# EAGLE schematic Transmitter (EAGLE 7.7.0)
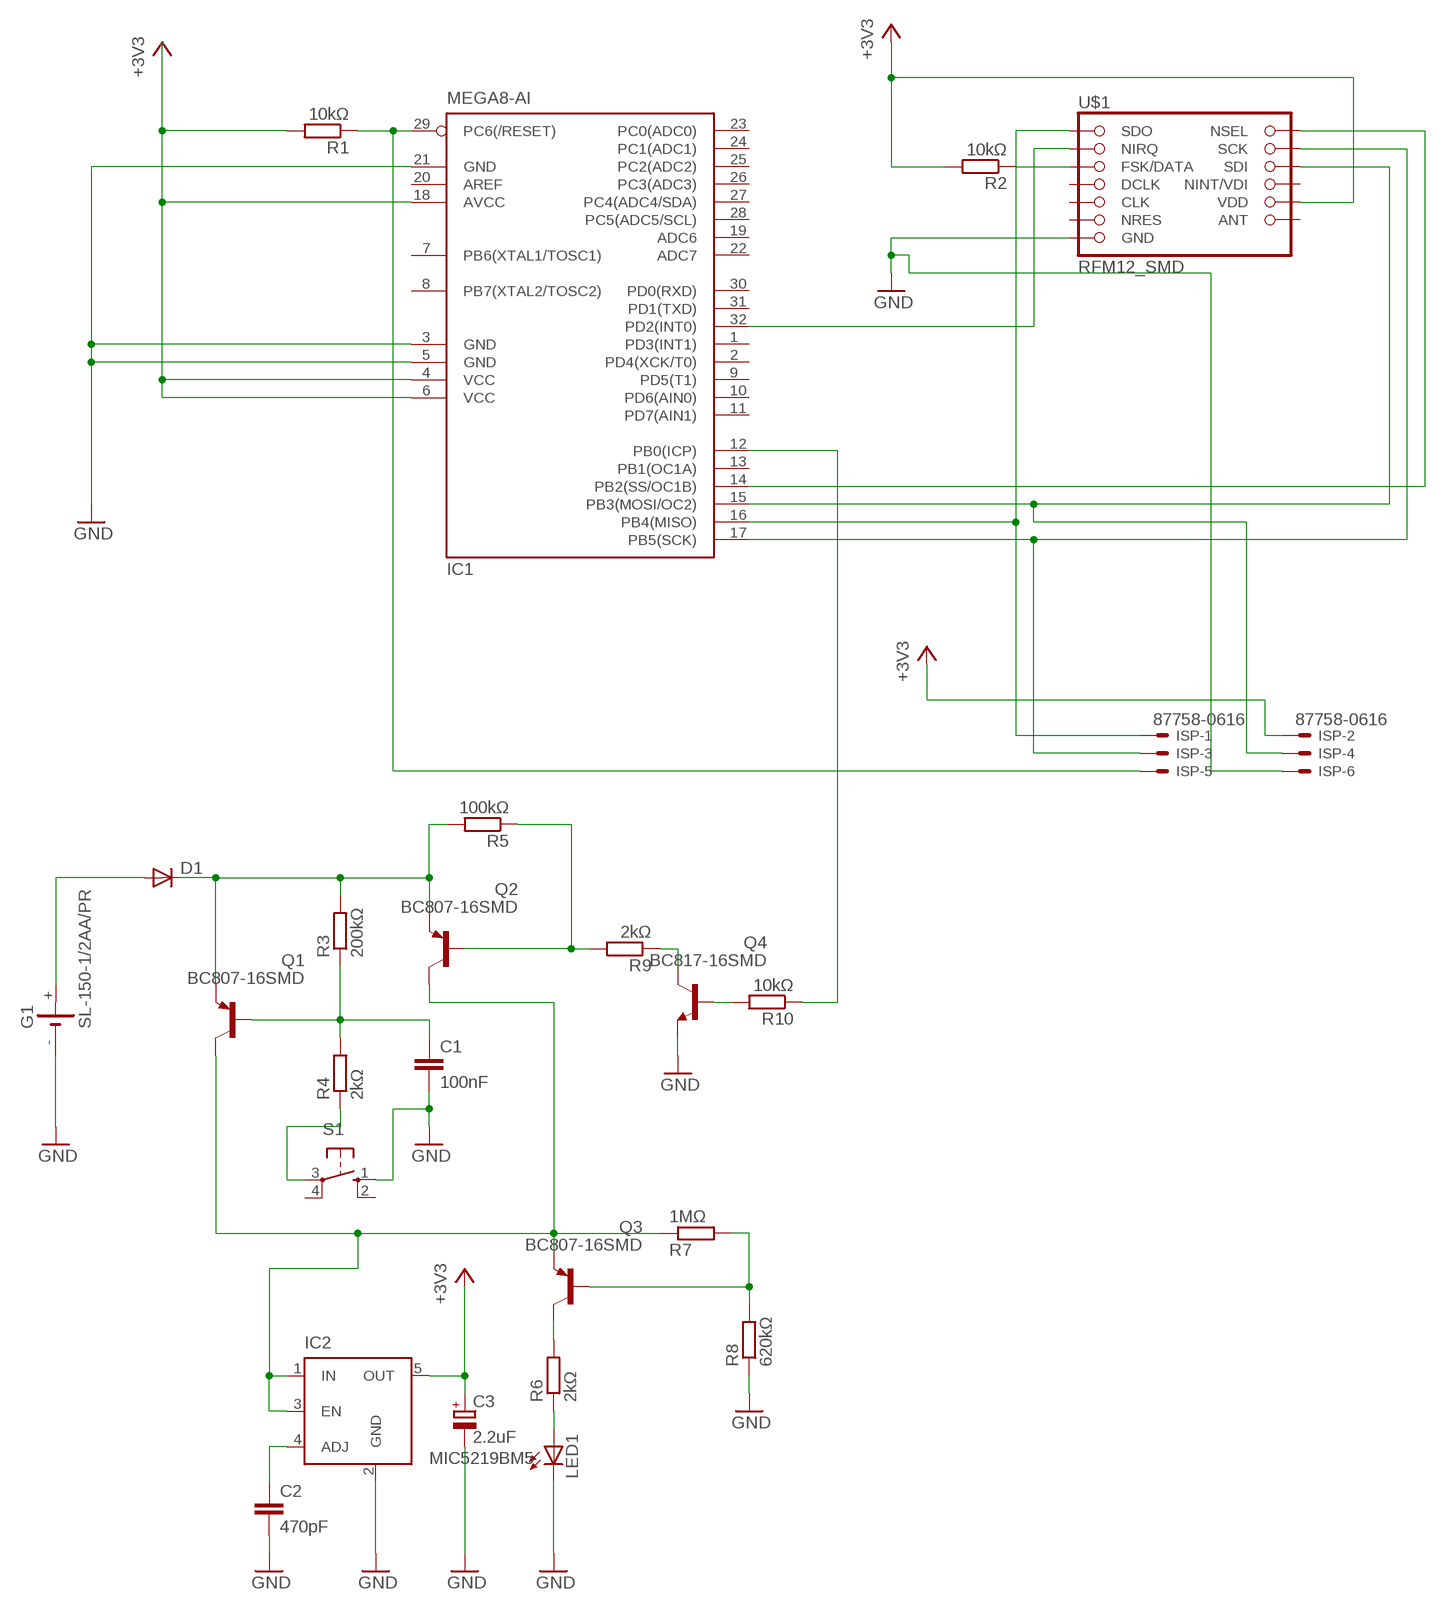
[diagram p0: schematic, sheet 1]

## Parts
C1  100nF  C-EUC0603  [C0603]
C2  470pF  C-EUC0603  [C0603]
C3  2.2uF  CPOL-EUSMCA  [SMC_A]
D1  DIODE-SOD80C  [SOD80C]
G1  SL-150-1/2AA/PR  [SL-150-1/2AA/PR]
IC1  MEGA8-AI  [TQFP32-08]
IC2  MIC5219BM5  [SOT23-5]
ISP  87758-0616  [87758-0616]
LED1  LED3MM  [LED3MM]
Q1  BC807-16SMD  [SOT23-BEC]
Q2  BC807-16SMD  [SOT23-BEC]
Q3  BC807-16SMD  [SOT23-BEC]
Q4  BC817-16SMD  [SOT23-BEC]
R1  10kΩ  R-EU_R0603  [R0603]
R2  10kΩ  R-EU_R0603  [R0603]
R3  200kΩ  R-EU_R0603  [R0603]
R4  2kΩ  R-EU_R0603  [R0603]
R5  100kΩ  R-EU_R0603  [R0603]
R6  2kΩ  R-EU_R0603  [R0603]
R7  1MΩ  R-EU_R0603  [R0603]
R8  620kΩ  R-EU_R0603  [R0603]
R9  2kΩ  R-EU_R0603  [R0603]
R10  10kΩ  R-EU_R0603  [R0603]
S1  10-XX  [B3F-10XX]
U$1  RFM12_SMD  [RFM12_SMD]

## Nets
+3V3: C3.+ IC1.4(VCC) IC1.6(VCC) IC1.18(AVCC) IC2.5(OUT) ISP.2 R1.2 R2.2 U$1.9(VDD)
GND: C1.2 C2.2 C3.- G1.- IC1.3(GND) IC1.5(GND) IC1.21(GND) IC2.2(GND) ISP.6 LED1.K(C) Q4.E R8.1 S1.1(S) U$1.7(GND) U$1.10(GND)
N$1: IC1.29(PC6(/RESET)) ISP.5 R1.1
N$2: IC1.12(PB0(ICP)) R10.1
N$3: D1.A G1.+
N$4: R2.1 U$1.3(FSK/DATA)
N$5: IC1.16(PB4(MISO)) ISP.1 U$1.1(SDO)
N$6: IC1.32(PD2(INT0)) U$1.2(NIRQ)
N$7: IC1.14(PB2(SS/OC1B)) U$1.14(NSEL)
N$8: IC1.17(PB5(SCK)) ISP.3 U$1.13(SCK)
N$9: IC1.15(PB3(MOSI/OC2)) ISP.4 U$1.12(SDI)
N$11: D1.C Q1.E Q2.E R3.2 R5.2
N$12: C1.1 Q1.B R3.1 R4.2
N$13: R4.1 S1.3(P)
N$14: Q2.B R5.1 R9.2
N$15: IC2.1(IN) IC2.3(EN) Q1.C Q2.C Q3.E R7.1
N$16: Q3.C R6.2
N$17: C2.1 IC2.4(ADJ)
N$18: LED1.A R6.1
N$19: Q3.B R7.2 R8.2
N$20: Q4.C R9.1
N$21: Q4.B R10.2
Unconnected: IC1.1(PD3(INT1)) IC1.2(PD4(XCK/T0)) IC1.7(PB6(XTAL1/TOSC1)) IC1.8(PB7(XTAL2/TOSC2)) IC1.9(PD5(T1)) IC1.10(PD6(AIN0)) IC1.11(PD7(AIN1)) IC1.13(PB1(OC1A)) IC1.19(ADC6) IC1.20(AREF) IC1.22(ADC7) IC1.23(PC0(ADC0)) IC1.24(PC1(ADC1)) IC1.25(PC2(ADC2)) IC1.26(PC3(ADC3)) IC1.27(PC4(ADC4/SDA)) IC1.28(PC5(ADC5/SCL)) IC1.30(PD0(RXD)) IC1.31(PD1(TXD)) S1.2(S1) S1.4(P1) U$1.4(DCLK) U$1.5(CLK) U$1.6(NRES) U$1.8(ANT) U$1.11(NINT/VDI)

## Library data of the parts
C1 C2 = rcl:C-EU: CAPACITOR, European symbol
C3 = rcl:CPOL-EU: POLARIZED CAPACITOR, European symbol
D1 = diode:DIODE-: DIODE
G1 = battery:SL-150-1/2AA/PR: LI BATTERY Sonnenschein
IC1 = atmel:MEGA8: MICROCONTROLLER 8 Kbytes FLASH, 1 kbytes SRAM, 512 bytes EEPROM, USART, 6-channel 10 bit ADC, 2-channel 8 bit ADC Pin compatible with Atmega48, ATMega88, ATMega168 Source: avr.lbr; MPN: ATMEGA8-16AU; OC_FARNELL: 9171371; OC_NEWARK: 73M8863
IC2 = v-reg-micrel:MIC5219BM5: VOLTAGE REGULATOR; MF: ALTERA CORPORATION; MPN: MIC5219BM5 TR; OC_FARNELL: 1100656; OC_NEWARK: 09J8939
ISP = con-molex:87758-0616: 6 Pin - 2mm Dual Row Single Wafer, Vertical T/H HDR Source: http://www.molex.com/pdm_docs/sd/877580616_sd.pdf; MPN: 87758-0616; OC_FARNELL: 7472323; OC_NEWARK: 25M5667
LED1 = led:LED: LED OSRAM: - CHIPLED LG R971, LG N971, LY N971, LG Q971, LY Q971, LO R971, LY R971 LH N974, LH R974 LS Q976, LO Q976, LY Q976 LO Q996 - Hyper CHIPLED LW Q18S LB Q993, LB Q99A, LB R99A - SideLED LS A670, LO A670, LY A670, LG A670, LP A670 LB A673, LV A673, LT A673, LW A673 LH A674 LY A675 LS A676, LA A676, LO A676, LY A676, LW A676 LS A679, LY A679, LG A679 - Hyper Micro SIDELED® LS Y876, LA Y876, LO Y876, LY Y876 LT Y87S - SmartLED LW L88C, LW L88S LB L89C, LB L89S, LG L890 LS L89K, LO L89K, LY L89K LS L896, LA L896, LO L896, LY L896 - TOPLED LS T670, LO T670, LY T670, LG T670, LP T670 LSG T670, LSP T670, LSY T670, LOP T670, LYG T670 LG T671, LOG T671, LSG T671 LB T673, LV T673, LT T673, LW T673 LH T674 LS T676, LA T676, LO T676, LY T676, LB T676, LH T676, LSB T676, LW T676 LB T67C, LV T67C, LT T67C, LS T67K, LO T67K, LY T67K, LW E67C LS E67B, LA E67B, LO E67B, LY E67B, LB E67C, LV E67C, LT E67C LW T67C LS T679, LY T679, LG T679 LS T770, LO T770, LY T770, LG T770, LP T770 LB T773, LV T773, LT T773, LW T773 LH T774 LS E675, LA E675, LY E675, LS T675 LS T776, LA T776, LO T776, LY T776, LB T776 LHGB T686 LT T68C, LB T68C - Hyper Mini TOPLED® LB M676 - Mini TOPLED Santana® LG M470 LS M47K, LO M47K, LY M47K Source: http://www.osram.convergy.de LUXEON: - LUMILED® LXK2-PW12-R00, LXK2-PW12-S00, LXK2-PW14-U00, LXK2-PW14-V00 LXK2-PM12-R00, LXK2-PM12-S00, LXK2-PM14-U00 LXK2-PE12-Q00, LXK2-PE12-R00, LXK2-PE12-S00, LXK2-PE14-T00, LXK2-PE14-U00 LXK2-PB12-K00, LXK2-PB12-L00, LXK2-PB12-M00, LXK2-PB14-N00, LXK2-PB14-P00, LXK2-PB14-Q00 LXK2-PR12-L00, LXK2-PR12-M00, LXK2-PR14-Q00, LXK2-PR14-R00 LXK2-PD12-Q00, LXK2-PD12-R00, LXK2-PD12-S00 LXK2-PH12-R00, LXK2-PH12-S00 LXK2-PL12-P00, LXK2-PL12-Q00, LXK2-PL12-R00 Source: www.luxeon.com KINGBRIGHT: KA-3528ASYC Source: www.kingbright.com
Q1-Q3 = transistor-pnp:BC807*: PNP Transistror
Q4 = transistor-npn:BC817*: NPN Transistor
R1-R10 = rcl:R-EU_: RESISTOR, European symbol
S1 = switch-omron:10-XX: OMRON SWITCH; MPN: B3F-1000; OC_FARNELL: 176432; OC_NEWARK: 36M3542
U$1 = RFM:RFM12_SMD